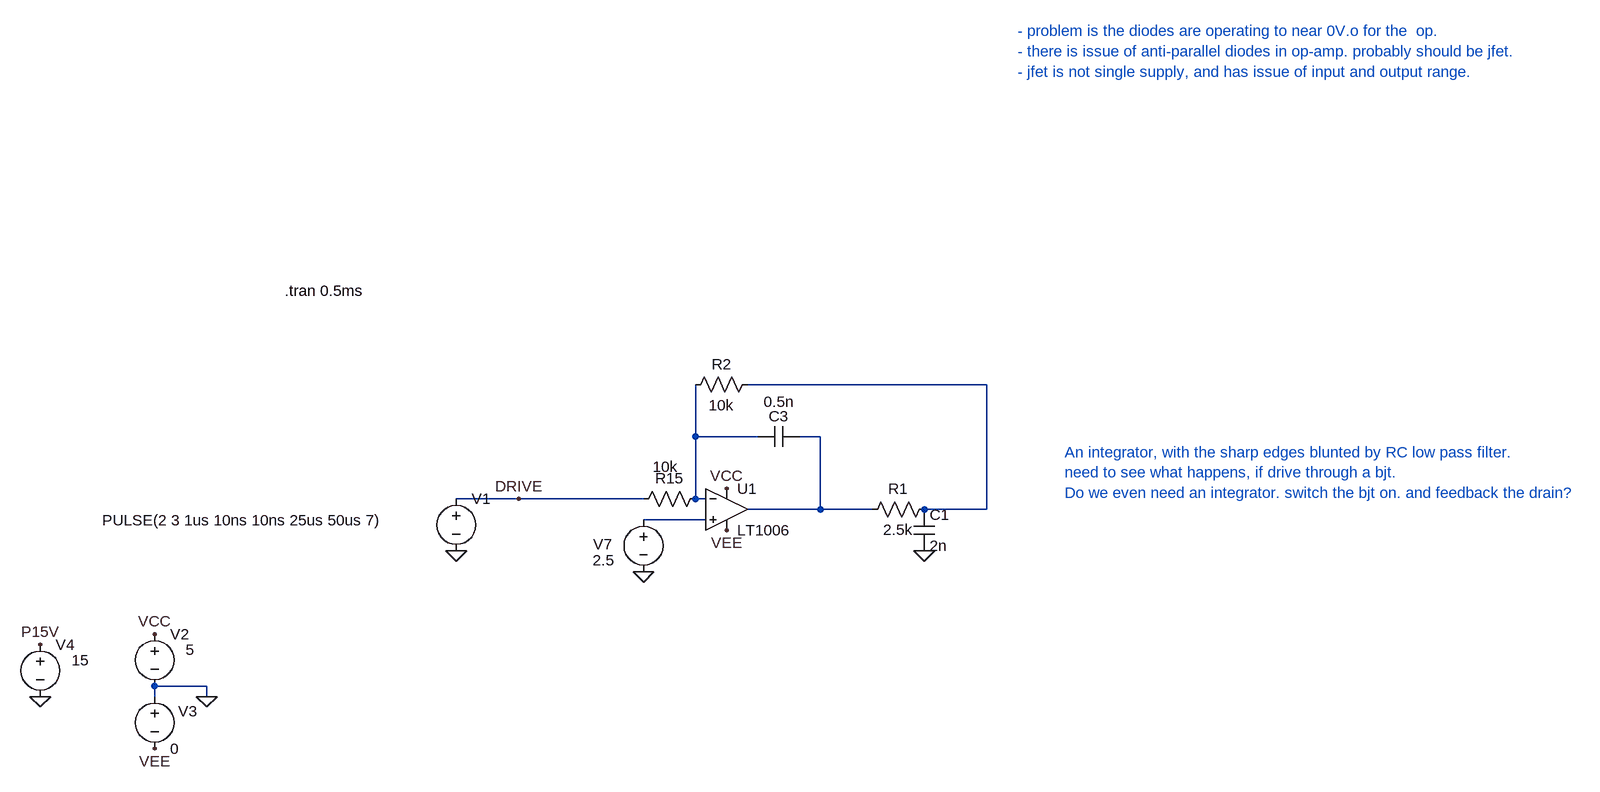
[diagram p0: schematic Draft67.asc]
Draft67.asc, the LTspice schematic file:
Version 4
SHEET 1 5720 1268
WIRE 992 -80 624 -80
WIRE 544 0 544 -80
WIRE 640 0 544 0
WIRE 736 0 704 0
WIRE 272 96 176 96
WIRE 464 96 272 96
WIRE 544 96 544 0
WIRE 560 96 544 96
WIRE 736 112 736 0
WIRE 736 112 624 112
WIRE 816 112 736 112
WIRE 992 112 992 -80
WIRE 992 112 896 112
WIRE 560 128 464 128
WIRE -208 384 -288 384
WIRE -288 400 -288 384
WIRE -208 400 -208 384
FLAG -208 400 0
FLAG -288 304 VCC
FLAG -288 480 VEE
FLAG -464 400 0
FLAG -464 320 P15V
FLAG 176 176 0
FLAG 272 96 DRIVE
FLAG 592 80 VCC
FLAG 592 144 VEE
FLAG 464 208 0
FLAG 896 176 0
SYMBOL voltage -288 288 R0
WINDOW 123 0 0 Left 0
WINDOW 39 0 0 Left 0
WINDOW 3 48 40 Left 2
SYMATTR Value 5
SYMATTR InstName V2
SYMBOL voltage -288 384 R0
WINDOW 123 0 0 Left 0
WINDOW 39 0 0 Left 0
WINDOW 0 36 39 Left 2
SYMATTR InstName V3
SYMATTR Value 0
SYMBOL voltage -464 304 R0
WINDOW 123 0 0 Left 0
WINDOW 39 0 0 Left 0
WINDOW 3 48 40 Left 2
SYMATTR Value 15
SYMATTR InstName V4
SYMBOL voltage 176 80 R0
WINDOW 123 0 0 Left 0
WINDOW 39 0 0 Left 0
WINDOW 3 -545 49 Left 2
SYMATTR Value PULSE(2 3 1us 10ns 10ns 25us 50us 7)
SYMATTR InstName V1
SYMBOL voltage 464 112 R0
WINDOW 123 0 0 Left 0
WINDOW 39 0 0 Left 0
WINDOW 3 -78 78 Left 2
WINDOW 0 -77 54 Left 2
SYMATTR Value 2.5
SYMATTR InstName V7
SYMBOL res 560 80 R90
WINDOW 0 0 56 VBottom 2
WINDOW 3 -49 62 VTop 2
SYMATTR InstName R15
SYMATTR Value 10k
SYMBOL OpAmps\\LT1006 592 48 R0
SYMATTR InstName U1
SYMBOL cap 880 112 R0
SYMATTR InstName C1
SYMATTR Value 2n
SYMBOL res 800 128 R270
WINDOW 0 32 56 VTop 2
WINDOW 3 0 56 VBottom 2
SYMATTR InstName R1
SYMATTR Value 2.5k
SYMBOL cap 704 -16 R90
WINDOW 0 0 32 VBottom 2
WINDOW 3 -53 31 VTop 2
SYMATTR InstName C3
SYMATTR Value 0.5n
SYMBOL res 640 -96 R90
WINDOW 0 0 56 VBottom 2
WINDOW 3 32 56 VTop 2
SYMATTR InstName R2
SYMATTR Value 10k
TEXT -88 -224 Left 2 !.tran 0.5ms
TEXT 1040 -624 Left 2 ;- problem is the diodes are operating to near 0V.o for the  op.\n- there is issue of anti-parallel diodes in op-amp. probably should be jfet.\n- jfet is not single supply, and has issue of input and output range.
TEXT 1112 24 Left 2 ;An integrator, with the sharp edges blunted by RC low pass filter.\nneed to see what happens, if drive through a bjt.\nDo we even need an integrator. switch the bjt on. and feedback the drain?

The netlist it stands for:
* Draft67.asc
V2 VCC 0 5
V3 0 VEE 0
V4 P15V 0 15
V1 DRIVE 0 PULSE(2 3 1us 10ns 10ns 25us 50us 7)
V7 N004 0 2.5
R15 N002 DRIVE 10k
XU1 N004 N002 VCC VEE N003 LT1006  ; pins In+ In- V+ V- OUT
C1 N001 0 2n
R1 N003 N001 2.5k
C3 N003 N002 0.5n
R2 N001 N002 10k
.tran 0.5ms
* - problem is the diodes are operating to near 0V.o for the  op.
* - there is issue of anti-parallel diodes in op-amp. probably should be jfet.
* - jfet is not single supply, and has issue of input and output range.
* An integrator, with the sharp edges blunted by RC low pass filter.
* need to see what happens, if drive through a bjt.
* Do we even need an integrator. switch the bjt on. and feedback the drain?
.lib LTC.lib
.backanno
.end